# EAGLE design i6 Dimmer (EAGLE 6.1)
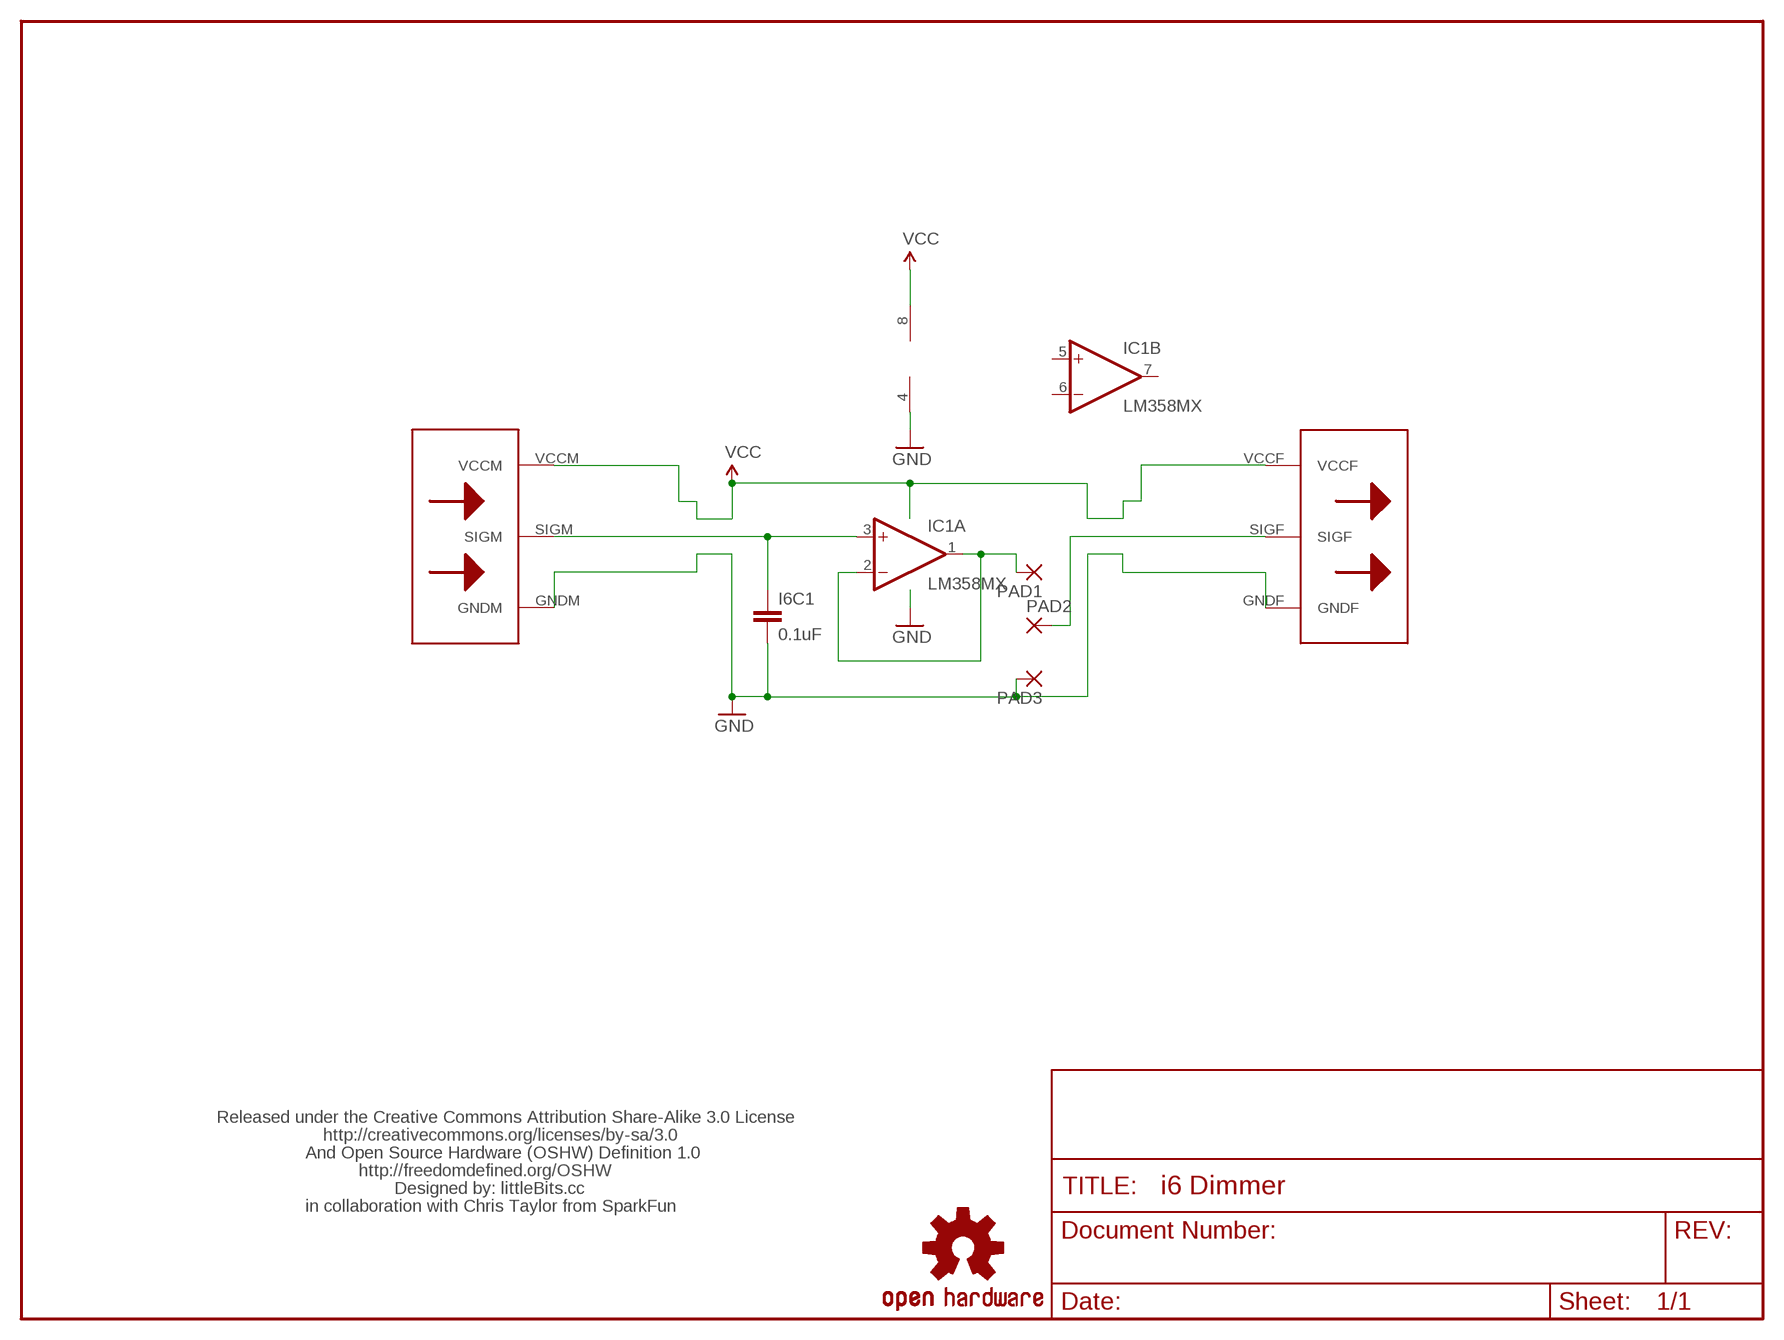
[diagram p0: schematic, sheet 1]

## Parts
I6C1  0.1uF  CAP1206  [1206]
IC1  LM358MX  [SO08]
PAD1  SMD5  [SMD2,54-5,08]
PAD2  SMD5  [SMD2,54-5,08]
PAD3  SMD5  [SMD2,54-5,08]
U$1  LB_CREDITS  [OSHWCREDIT]
U$3  OSHW-LOGOL  [OSHW-LOGO-L]
U$6  BIGBIT  [BIGBIT]

## Nets
GND: I6C1.2 IC1.4(P:V-) PAD3.1(P) U$6.GNDF U$6.GNDM
N$1: IC1.1(A:OUT) IC1.2(A:-IN) PAD1.1(P)
POT: PAD2.1(P) U$6.SIGF
SIG: I6C1.1 IC1.3(A:+IN) U$6.SIGM
VCC: IC1.8(P:V+) U$6.VCCF U$6.VCCM
Unconnected: IC1.5(B:+IN) IC1.6(B:-IN) IC1.7(B:OUT)

## Library data of the parts
I6C1 = SparkFun:CAP: Capacitor Standard 0603 ceramic capacitor, and 0.1" leaded capacitor.
IC1 = linear:LM358: OP AMP also LM158; LM258; LM2904 Source: http://cache.national.com/ds/LM/LM158.pdf
PAD1-PAD3 = wirepad:SMD5: SMD PAD
U$1 = LITTLEBITS:LB_CREDITS
U$3 = SparkFun:OSHW-LOGO: Open Source Hardware Logo This logo indicates the piece of hardware it is found on incorporates a OSHW license and/or adheres to the definition of open source hardware found here: http://freedomdefined.org/OSHW
U$6 = bigbits:BIGBIT: BigBit completo Male entra o Sinal Female sai o Sinal Esquerda --> Direita

## Board
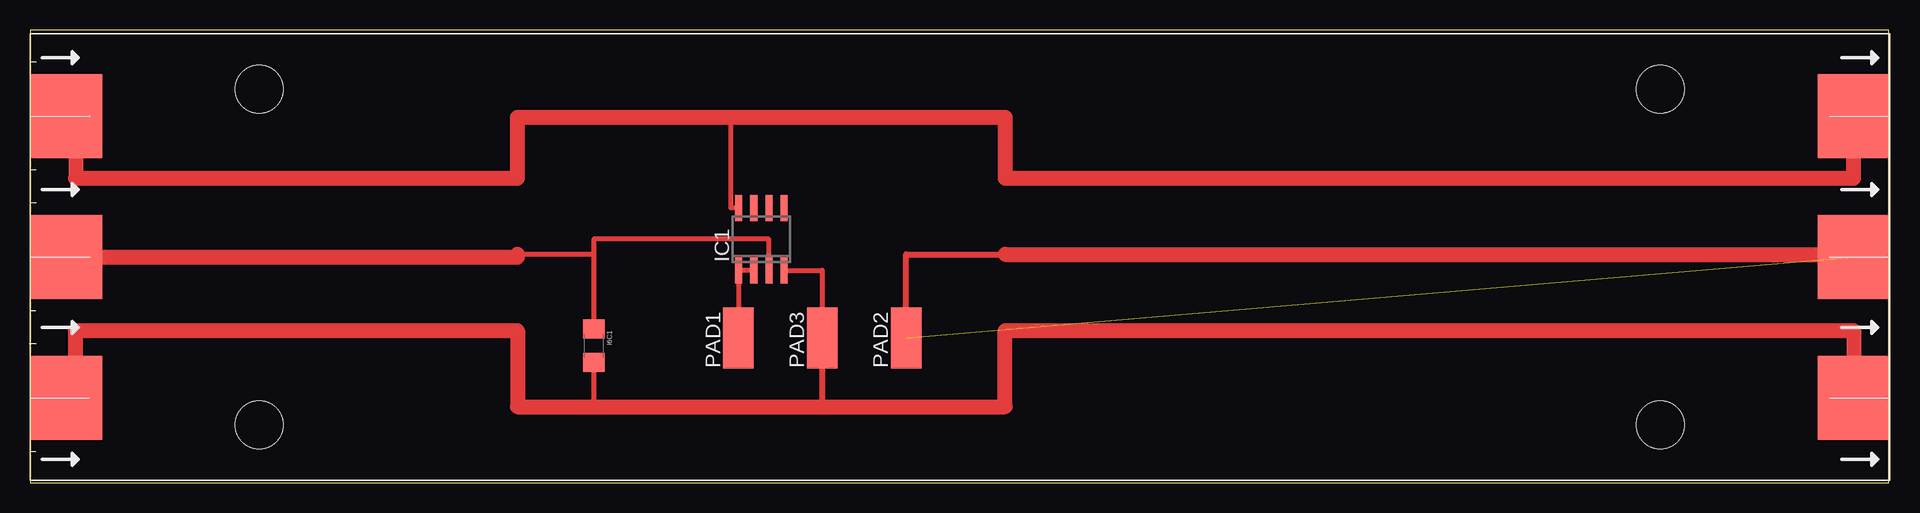
[diagram p1: board, top side]

Size 154.92 x 37.77 mm. Coordinates in mm from the lower left corner, seen from the top.
Outline: 0,0 154.92,0 154.92,37.77 0,37.77 0,0
Copper layers (1*16): Top 0.035mm / dielectric 1.5mm / Bottom 0.035mm
Design rules: minimum track width 10mil, minimum drill 24mil, track to track 8mil, track to pad 8mil, pad to pad 8mil, via to via 8mil, smd to smd 8mil, copper to edge 40mil, drill to drill 8mil, minimum pad ring 10mil, minimum via ring 8mil, stop-mask expansion 4mil, vias tented up to drill 0mil, thermal gap 10mil

### Footprints (pad centres in the part's own frame; a part is rotated, then mirrored left to right if it is on the bottom)
1206 = smd 1.6 x 1.8: 1 -1.4,0; 2 1.4,0
SO08 = smd 0.6 x 2.2: 1 -1.905,-2.6; 2 -0.635,-2.6; 3 0.635,-2.6; 4 1.905,-2.6; 5 1.905,2.6; 6 0.635,2.6; 7 -0.635,2.6; 8 -1.905,2.6
SMD2,54-5,08 = smd 2.54 x 5.08: 1 0,0
BIGBIT = smd 6 x 7: GNDF 152,-30.38; GNDM 3,-30.38; SIGF 152,-18.64; SIGM 3,-18.64; VCCF 152,-6.89; VCCM 3,-6.89 | hole 4: 135.9,-4.64; 135.9,-32.639; 19.1,-4.64; 19.1,-32.639

### Placement (x,y rotation side)
I6C1  46.99,11.43 270 top
IC1  60.96,20.32 0 top
PAD1  59.05,12.06 0 top
PAD2  73.03,12.06 0 top
PAD3  66.04,12.06 0 top
U$1  -48.26,1.27 0 top  (outside the outline)
U$3  -41.91,34.29 0 top  (outside the outline)
U$6  0,37.47 0 top

### Tracks (layer width: path | path; a pad name or v marks a point on that pad's centre or on a via)
GND
  Top 0.406: I6C1.2 46.99,6.35 | IC1.4 66.04,17.72 66.04,12.7
  Top 0.508: PAD3.1 66.04,6.35
  Top 1.27: U$6.GNDM 3.81,7.08 3.81,12.7 40.64,12.7 40.64,6.35 46.99,6.35 66.04,6.35 81.28,6.35 81.28,12.7 152,12.7 U$6.GNDF
  Top 2.184: 66.04,11.43 PAD3.1 66.04,12.7
N$1
  Top 0.406: IC1.2 IC1.1 PAD1.1
N$2
  Top 2.184: 59.05,11.43 59.05,12.7
N$4
  Top 0.508: 73.03,12.06 73.03,19.05 81.28,19.05
  Top 1.27: 81.28,19.05 151.76,19.05
  Top 2.184: 73.03,11.43 73.03,12.06 73.03,12.7
POT  (1 unrouted)
SIG
  Top 0.406: 46.99,19.05 46.99,20.32 61.59,20.32 IC1.3 | 46.99,19.05 I6C1.1 | 46.99,19.05 40.64,19.05
  Top 1.27: U$6.SIGM 40.64,18.82 40.64,19.05
VCC
  Top 0.406: IC1.8 58.42,22.92 58.42,30.48
  Top 1.27: U$6.VCCM 3.81,30.57 3.81,25.4 40.64,25.4 40.64,30.48 58.42,30.48 81.28,30.48 81.28,25.4 152,25.4 U$6.VCCF